# EAGLE design MainPCB (EAGLE 9.6.2)
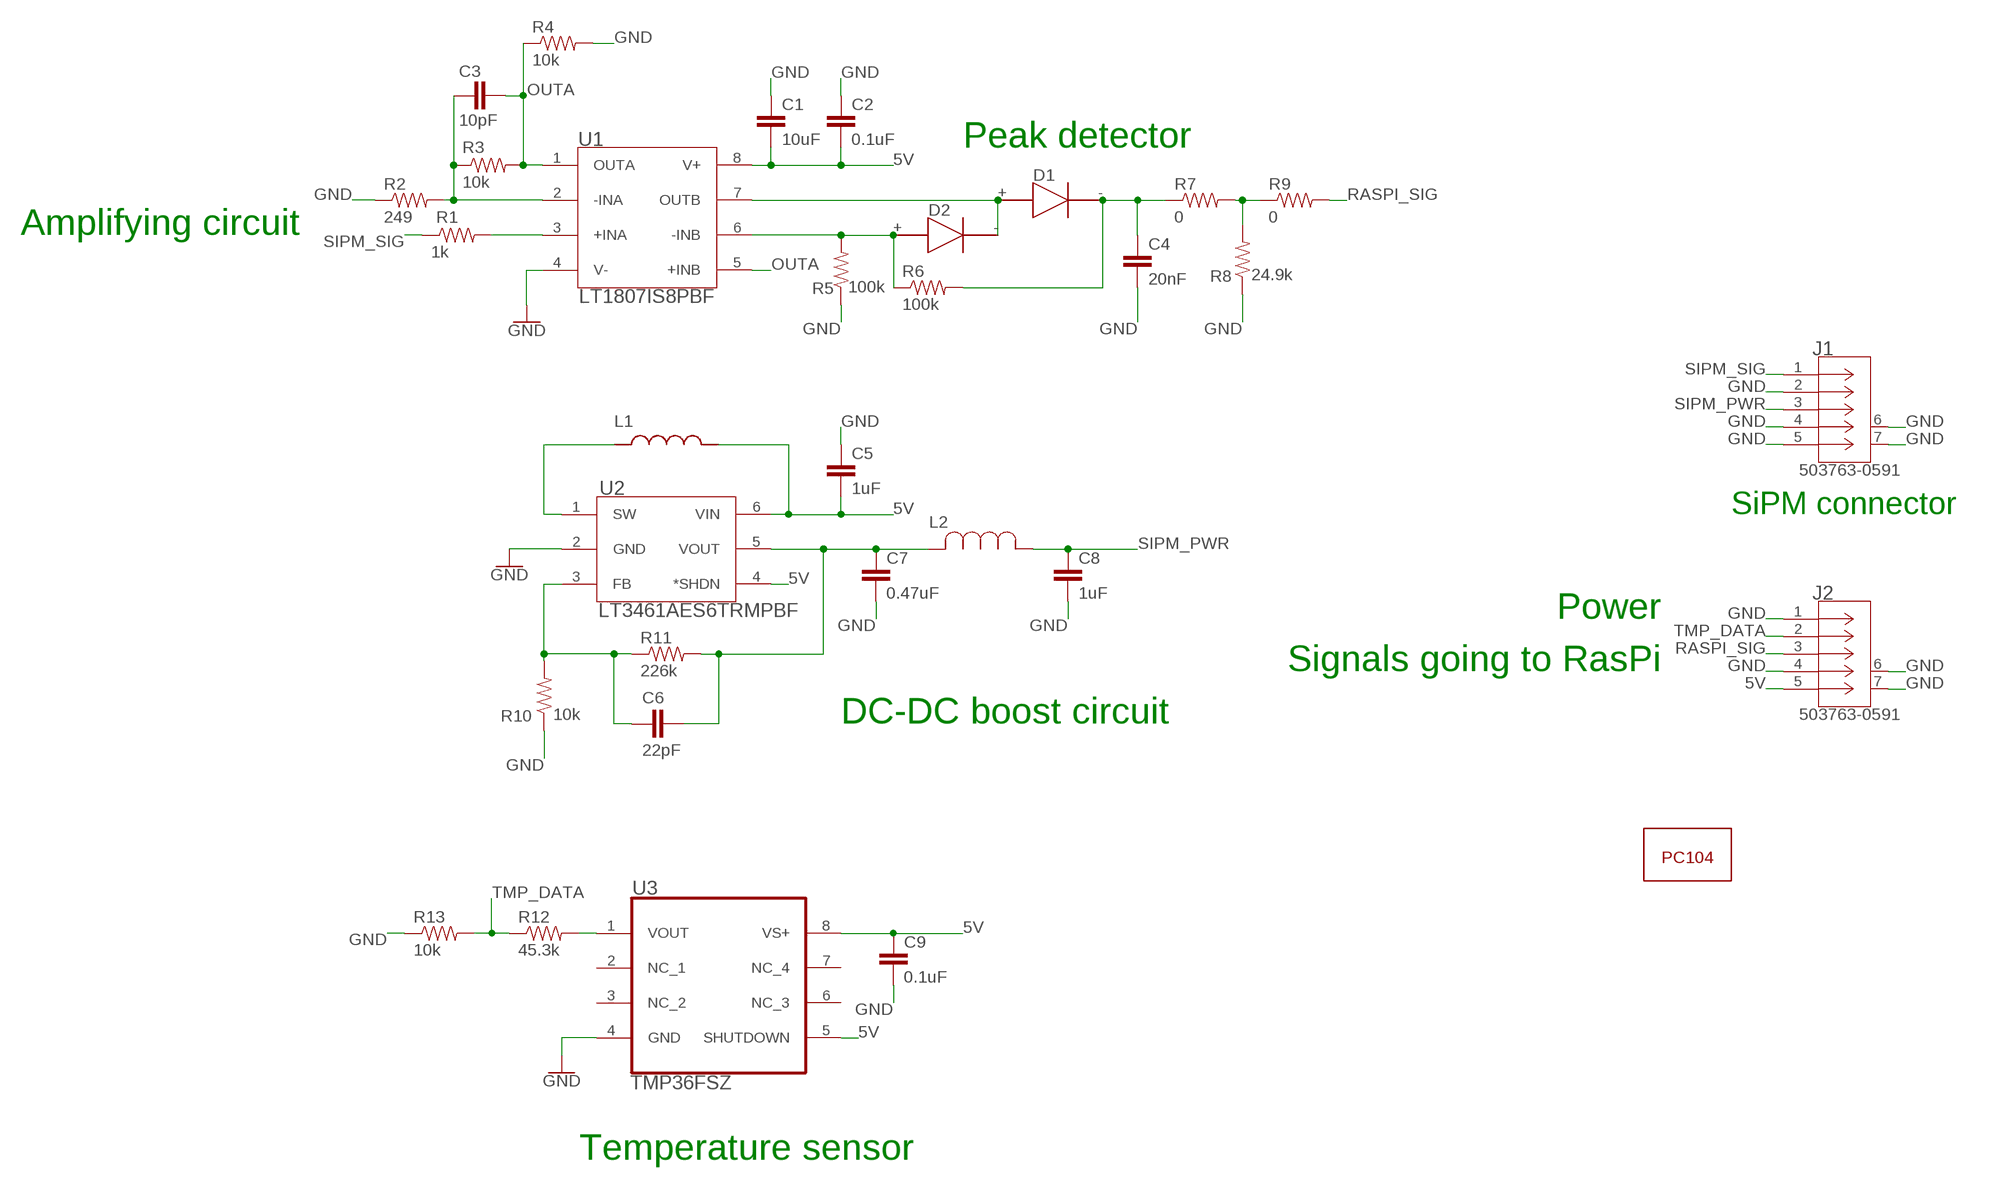
[diagram p0: schematic, sheet 1]

## Parts
C1  10uF  CAP0805  [0805]
C2  0.1uF  CAP0805  [0805]
C3  10pF  CAP0805  [0805]
C4  20nF  CAP0805  [0805]
C5  1uF  CAP0805  [0805]
C6  22pF  CAP0805  [0805]
C7  0.47uF  CAP0805  [0805]
C8  1uF  CAP0805  [0805]
C9  0.1uF  CAP0805  [0805]
D1  RBR1VWM40ATR  [RBR1VWM40ATR]
D2  RBR1VWM40ATR  [RBR1VWM40ATR]
J1  503763-0591  [CONN_5037630591_MOL]
J2  503763-0591  [CONN_5037630591_MOL]
L1  47uH  LQH32CN470K53L  [IND_LQH32CN470K53L]
L2  BK2125LM252-T  [BK2125HS_TAY]
R1  1k  RESISTOR0805-RES  [0805]
R2  249  RESISTOR0805-RES  [0805]
R3  10k  RESISTOR0805-RES  [0805]
R4  10k  RESISTOR0805-RES  [0805]
R5  100k  RESISTOR0805-RES  [0805]
R6  100k  RESISTOR0805-RES  [0805]
R7  0  RESISTOR0805-RES  [0805]
R8  24.9k  RESISTOR0805-RES  [0805]
R9  0  RESISTOR0805-RES  [0805]
R10  10k  RESISTOR0805-RES  [0805]
R11  226k  RESISTOR0805-RES  [0805]
R12  45.3k  RESISTOR0805-RES  [0805]
R13  10k  RESISTOR0805-RES  [0805]
U1  LT1807IS8PBF  [MSOP-8_MS_LIT]
U2  LT3461AES6TRMPBF  [TSOT-23_S6]
U3  TMP36FSZ  TMP36GSZ  [SOIC127P600X175-8N]
U$1  PC104_WCONN_DETECTOR  [PC104_WCONN_DETECTOR]

## Nets
5V: C1.2 C2.2 C5.2 C9.1 J2.5 L1.2 U1.8(V+) U2.4(*SHDN) U2.6(VIN) U3.5(SHUTDOWN) U3.8(VS+)
GND: C1.1 C2.1 C4.2 C5.1 C7.2 C8.2 C9.2 J1.2 J1.4 J1.5 J1.6 J1.7 J2.1 J2.4 J2.6 J2.7 R2.1 R4.2 R5.1 R8.1 R10.1 R13.1 U1.4(V-) U2.2(GND) U3.4(GND)
N$1: R1.2 U1.3(+INA)
N$2: C3.1 R2.2 R3.1 U1.2(-INA)
N$4: D2.+ R5.2 R6.1 U1.6(-INB)
N$5: C4.1 D1.- R6.2 R7.1
N$6: D1.+ D2.- U1.7(OUTB)
N$7: R7.2 R8.2 R9.1
N$8: L1.1 U2.1(SW)
N$9: C6.1 R10.2 R11.1 U2.3(FB)
N$10: C6.2 C7.1 L2.2 R11.2 U2.5(VOUT)
N$11: R12.2 U3.1(VOUT)
OUTA: C3.2 R3.2 R4.1 U1.1(OUTA) U1.5(+INB)
RASPI_SIG: J2.3 R9.2
SIPM_PWR: C8.1 J1.3 L2.1
SIPM_SIG: J1.1 R1.1
TMP_DATA: J2.2 R12.1 R13.2
Unconnected: U3.2(NC_1) U3.3(NC_2) U3.6(NC_3) U3.7(NC_4)

## Notes on the sheet
- Peak detector
- Amplifying circuit
- SiPM connector
- Power
- Signals going to RasPi
- DC-DC boost circuit
- Temperature sensor

## Library data of the parts
C1-C9 = HSFL_Main_Library:CAP: Capacitor Standard 0603 ceramic capacitor, and 0.1" leaded capacitor.
D1 D2 = RBR1VWM40ATR:RBR1VWM40ATR
J1 J2 = Molex - 503763-0591:503763-0591; BUILT_BY: EMA_Cory; COPYRIGHT: Copyright (C) 2018 Accelerated Designs. All rights reserved; DATASHEET: https://www.molex.com/pdm_docs/sd/5037630591_sd.pdf; MANUFACTURER_PART_NUMBER: 503763-0591; SOURCELIBRARY: Add_to_database_2020-12-14; VENDOR: Molex Connector Corporation
L1 = LQH32CN470K53L:LQH32CN470K53L: Wire Wound Ferrite Inductor for Power Lines For Automotive; DESCRIPTION: Inductor with Inductance: 47uH Tol. +/-10%, Package: 1210 (3225); DIGI-KEY_PART_NUMBER: 490-4063-1-ND; MF: Murata; MP: LQH32CN470K53L; PACKAGE: NONSTANDARD; PURCHASE-URL: https://pricing.snapeda.com/search/part/LQH32CN470K53L/?ref=eda
L2 = BK2125LM252-T:BK2125LM252-T; COPYRIGHT: Copyright (C) 2021 Ultra Librarian. All rights reserved.; DIGI-KEY_PART_NUMBER_1: 587-1919-1-ND; DIGI-KEY_PART_NUMBER_2: 587-1919-2-ND; DIGI-KEY_PART_NUMBER_3: 587-1919-6-ND; MANUFACTURER_PART_NUMBER: BK2125LM252-T; MFR_NAME: Taiyo Yuden
R1-R13 = HSFL_Main_Library:RESISTOR: Resistor Basic schematic elements and footprints for 0603, 1206, and PTH resistors.
U1 = LT1807:LT1807IS8PBF; COPYRIGHT: Copyright (C) 2021 Ultra Librarian. All rights reserved.; DIGI-KEY_PART_NUMBER_1: LT1807IS8#PBF-ND; MANUFACTURER_PART_NUMBER: LT1807IS8#PBF; MFR_NAME: Analog Devices / Linear Technology
U2 = LT3461:LT3461AES6TRMPBF; DESCRIPTION: Conv DC-DC 2.5V to 16V Step Up Single-Out 38V 0.6A Automotive 6-Pin TSOT-23 T/R; DIGI-KEY_PART_NUMBER: LT3461AES6#TRMPBFCT-ND; MF: Analog Devices; MP: LT3461AES6#TRMPBF; PACKAGE: SOT-6 Analog Devices; PURCHASE-URL: https://pricing.snapeda.com/search/part/LT3461AES6#TRMPBF/?ref=eda
U3 = TMP36GSZ:TMP36GSZ
U$1 = HSFL_Main_Library:PC104_WCONN_DETECTOR

## Board
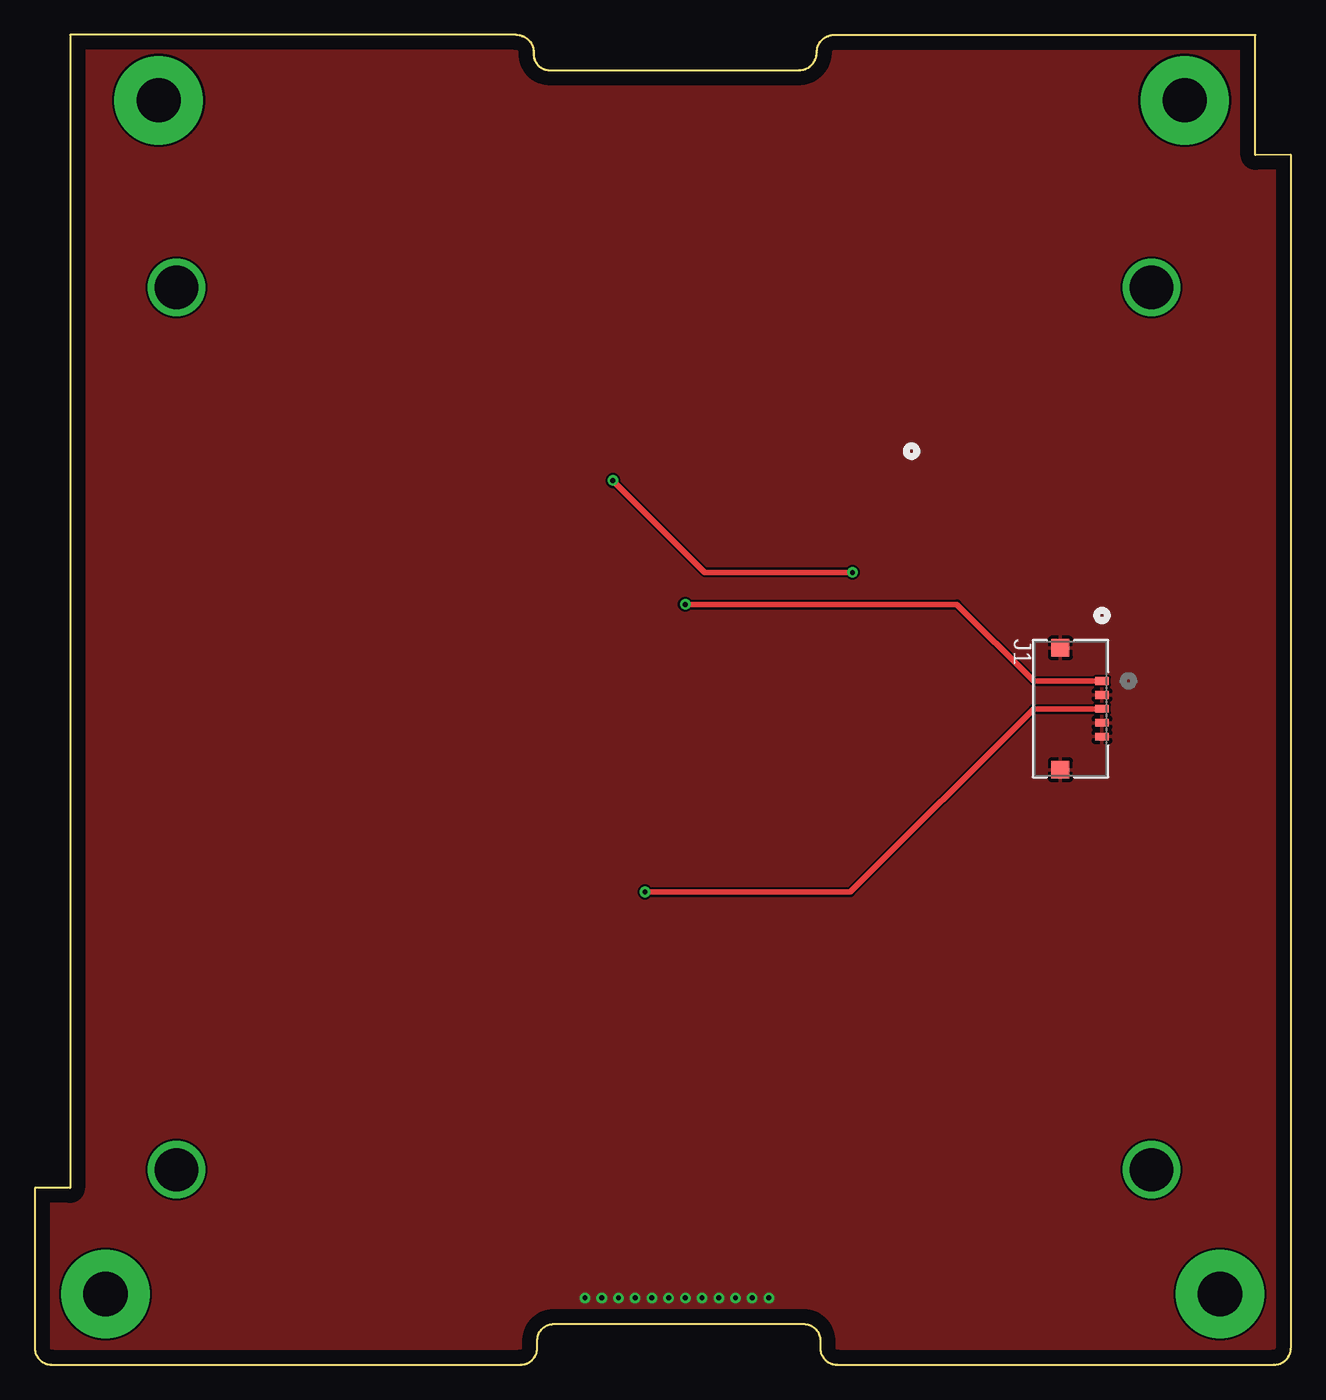
[diagram p1: board, top side]
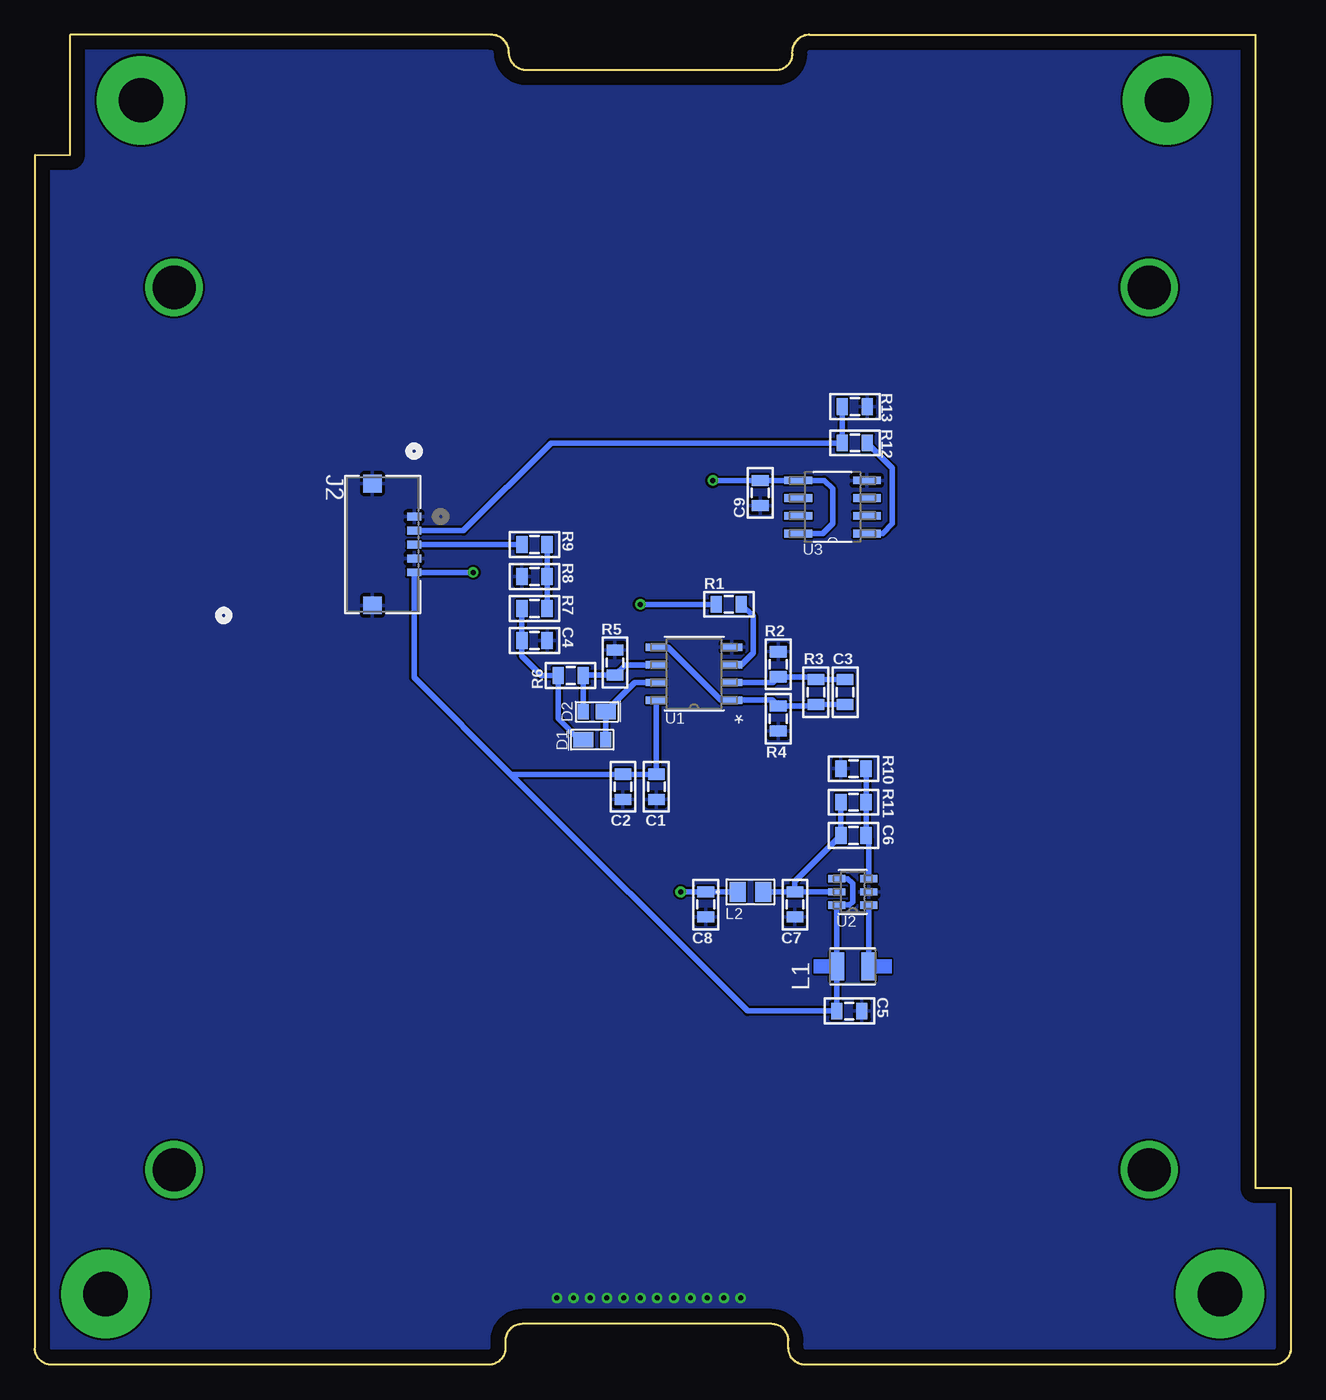
[diagram p2: board, bottom side, seen from below]

Size 90.17 x 95.5 mm. Coordinates in mm from the lower left corner, seen from the top.
Copper layers (1*16): Top 0.035mm / dielectric 1.5mm / Bottom 0.035mm
Design rules "default": minimum track width 6mil, minimum drill 0.35mm, track to track 6mil, track to pad 6mil, pad to pad 6mil, via to via 6mil, smd to smd 6mil, copper to edge 40mil, drill to drill 6mil, minimum pad ring 10mil, minimum via ring 8mil, stop-mask expansion 4mil, vias tented up to drill 0mil, thermal gap 10mil

### Footprints (pad centres in the part's own frame; a part is rotated, then mirrored left to right if it is on the bottom)
0805 = smd 0.8 x 1.2: 1 -0.9,0; 2 0.9,0
RBR1VWM40ATR = smd 0.8 x 1.1: + -0.65,0 | smd 1.45 x 1.1: - 0.975,0
CONN_5037630591_MOL = smd 0.559 x 0.991: 1 -2,2.261; 2 -1,2.261; 3 0,2.261; 4 1,2.261; 5 2,2.261 | smd 1.27 x 1.295: 6 -4.375,-0.729; 7 4.375,-0.729
IND_LQH32CN470K53L = smd 1 x 2: 1 -1.15,0; 2 1.15,0
BK2125HS_TAY = smd 1.15 x 1.45: 1 -0.925,0; 2 0.925,0
MSOP-8_MS_LIT = smd 1.455 x 0.533: 1 -2.725,1.932; 2 -2.725,0.662; 3 -2.725,-0.608; 4 -2.725,-1.878; 5 2.717,-1.878; 6 2.717,-0.608; 7 2.717,0.662; 8 2.717,1.932
TSOT-23_S6 = smd 1.219 x 0.508: 1 -1.143,0.95; 2 -1.143,0; 3 -1.143,-0.95; 4 1.143,-0.95; 5 1.143,0; 6 1.143,0.95
SOIC127P600X175-8N = smd 1.981 x 0.559: 1 -2.464,1.905; 2 -2.464,0.635; 3 -2.464,-0.635; 4 -2.464,-1.905; 5 2.464,-1.905; 6 2.464,-0.635; 7 2.464,0.635; 8 2.464,1.905
PC104_WCONN_DETECTOR = drill 3.175 pad 6.35: P$1 5.08,5.08; P$2 85.09,5.08; P$3 82.55,90.805; P$4 8.89,90.805 | drill 3.1: P$5 10.17,14; P$6 80.17,14; P$7 80.17,77.37; P$8 10.17,77.37

### Placement (x,y rotation side)
C1  45.55,41.5 90 bottom
C2  47.95,41.5 90 bottom
C3  32,48.3 270 bottom
C4  54.3,52 0 bottom
C5  31.7,25.4 180 bottom
C6  31.4,38 180 bottom
C7  35.6,33.05 270 bottom
C8  42,33.05 270 bottom
C9  38.1,62.6 270 bottom
D1  49.83,44.88 180 bottom
D2  50.15,46.9 0 bottom
J1  74.35,47.1 270 top
J2  65.2,58.9 270 bottom
L1  31.45,28.6 180 bottom
L2  38.8,33.95 0 bottom
R1  40.35,54.6 0 bottom
R2  36.8,50.3 270 bottom
R3  34.1,48.3 270 bottom
R4  36.8,46.4 270 bottom
R5  48.52,50.42 270 bottom
R6  51.7,49.5 180 bottom
R7  54.3,54.3 0 bottom
R8  54.3,56.6 0 bottom
R9  54.3,58.9 180 bottom
R10  31.4,42.8 0 bottom
R11  31.4,40.4 180 bottom
R12  31.3,66.2 0 bottom
R13  31.3,68.8 180 bottom
U1  42.85,49.65 180 bottom
U2  31.45,33.95 180 bottom
U3  32.9,61.6 180 bottom
U$1  0,0 0 top

### Tracks (layer width: path | path; a pad name or v marks a point on that pad's centre or on a via)
5V  (via drill 0.35)
  Top 0.406: v58.7,56.9 48.1,56.9 v41.5,63.5
  Bottom 0.406: U3.8 33.6,59.7 32.9,60.4 32.9,62.9 33.51,63.51 U3.5 C9.1 v41.5,63.5 | U2.4 31.8,34.9 31.45,34.55 31.45,33.25 31.7,33 U2.6 L1.2 C5.2 39,25.4 56,42.4 | 56,42.4 C2.2 C1.2 45.57,42.42 U1.8 | 56,42.4 62.94,49.34 J2.5 v58.7,56.9
GND  (via drill 0.35)
  other vias: 52.7,4.8 51.5,4.8 50.3,4.8 49.1,4.8 47.9,4.8 46.7,4.8 45.5,4.8 44.3,4.8 43.1,4.8 41.9,4.8 40.7,4.8 39.5,4.8
  pour Top: -0.4,96.2 -0.4,-0.4 90.4,-0.4 90.4,1 90.4,96.2 89,96.2
  pour Bottom: -0.6,96.4 90.6,96.4 90.6,-0.6 -0.6,-0.6
N$1
  Bottom 0.406: R1.2 38.6,53.75 38.6,51.1 39.44,50.26 U1.3
N$2
  Bottom 0.406: C3.1 R3.1 34.3,49.4 R2.2 37.21,48.99 U1.2
N$4
  Bottom 0.406: D2.+ R6.1 50.77,49.52 R5.2 47.79,50.26 U1.6
N$5
  Bottom 0.406: R7.1 C4.1 55.2,50.9 53.8,49.5 R6.2 52.6,46.4 51.08,44.88 D1.-
N$6
  Bottom 0.406: D1.+ D2.- 47.09,48.99 U1.7
N$7
  Bottom 0.406: R9.1 R8.2 R7.2
N$8
  Bottom 0.406: U2.1 L1.1
N$9
  Bottom 0.406: R10.2 R11.1 C6.1 30.31,37.81 U2.3
N$10
  Bottom 0.406: R11.2 C6.2 35.6,34.7 C7.1 | U2.5 C7.1 | C7.1 L2.2
N$11
  Bottom 0.406: R12.2 28.6,64.4 28.6,60.4 29.3,59.7 U3.1
OUTA
  Bottom 0.406: C3.2 R3.2 34.2,47.3 R4.1 37.22,47.72 U1.1 40.92,47.72 44.73,51.53 U1.5
RASPI_SIG
  Bottom 0.406: J2.3 R9.2
SIPM_PWR  (via drill 0.35)
  Top 0.406: J1.3 71.7,47.1 58.55,33.95 v43.8,33.95
  Bottom 0.406: L2.1 C8.1 v43.8,33.95
SIPM_SIG  (via drill 0.35)
  Top 0.406: J1.1 71.7,49.1 66.2,54.6 v46.7,54.6
  Bottom 0.406: R1.1 v46.7,54.6
TMP_DATA
  Bottom 0.406: R13.2 R12.1 53.1,66.2 59.4,59.9 J2.2